# Altium schematic sheet 三级管红外发射.SchDoc
size A4
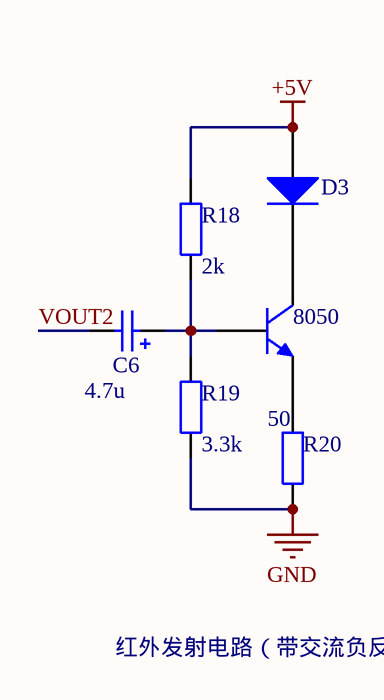
[diagram p0: 三级管红外发射.SchDoc]

## Parts
8050  NPN  [TO-226]  (value not drawn)
C6  电解电容  [电解电容]  (value not drawn)
D3  Diode  [SMC]  (value not drawn)
R18  value 2k  [AXIAL-0.4]  (hidden comment: Res2)
R19  value 3.3k  [AXIAL-0.4]  (hidden comment: Res2)
R20  value 50  [AXIAL-0.4]  (hidden comment: Res2)

## Nets
+5V: D3.1(A) R18.2
GND: R19.1 R20.1
VOUT2: C6.2
Net8050_1: 8050.1(C) D3.2(K)
Net8050_2: 8050.2(B) C6.1 R18.1 R19.2
Net8050_3: 8050.3(E) R20.2

## Notes on the sheet
- 红外发射电路（带交流负反馈）
- (in symbol 电解电容) 4.7u

## Library data of the parts
8050 = NPN: NPN Bipolar Transistor; Published: 8-Jun-2000; LatestRevisionDate: 17-Jul-2002; LatestRevisionNote: Re-released for DXP Platform.; PackageReference: TO-226; Publisher: Altium Limited; Code_JEDEC: TO-226-AA
D3 = Diode: Default Diode; Published: 8-Jun-2000; LatestRevisionDate: 17-Jul-2002; LatestRevisionNote: Re-released for DXP Platform.; PackageDocument: Sep-1996; PackageReference: SMC; Publisher: Altium Limited; Code_JEDEC: DO-214-AB
R18-R20 = Res2: Resistor; Published: 8-Jun-2000; LatestRevisionDate: 17-Jul-2002; LatestRevisionNote: Re-released for DXP Platform.; PackageReference: AXIAL-0.4; Publisher: Altium Limited